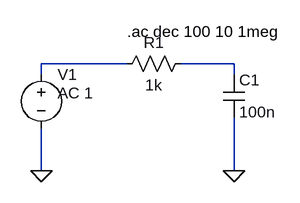
[diagram p0: schematic AC Circuit.asc]
AC Circuit.asc, the LTspice schematic file:
Version 4.1
SHEET 1 880 680
WIRE 256 -80 128 -80
WIRE 416 -80 336 -80
WIRE 128 -64 128 -80
WIRE 416 -64 416 -80
WIRE 128 80 128 16
WIRE 416 80 416 0
FLAG 416 80 0
FLAG 128 80 0
SYMBOL voltage 128 -80 R0
WINDOW 123 24 44 Left 2
WINDOW 39 0 0 Left 0
SYMATTR InstName V1
SYMATTR Value ""
SYMATTR Value2 AC 1
SYMBOL res 352 -96 R90
WINDOW 0 0 56 VBottom 2
WINDOW 3 32 56 VTop 2
SYMATTR InstName R1
SYMATTR Value 1k
SYMBOL cap 400 -64 R0
SYMATTR InstName C1
SYMATTR Value 100n
TEXT 256 -128 Left 2 !.ac dec 100 10 1meg

The netlist it stands for:
* AC Circuit.asc
V1 N001 0 AC 1
R1 N002 N001 1k
C1 N002 0 100n
.ac dec 100 10 1meg
.backanno
.end